# Altium schematic sheet Badschematic.SchDoc
size A4; SheetNumber: 1; SheetTotal: 2
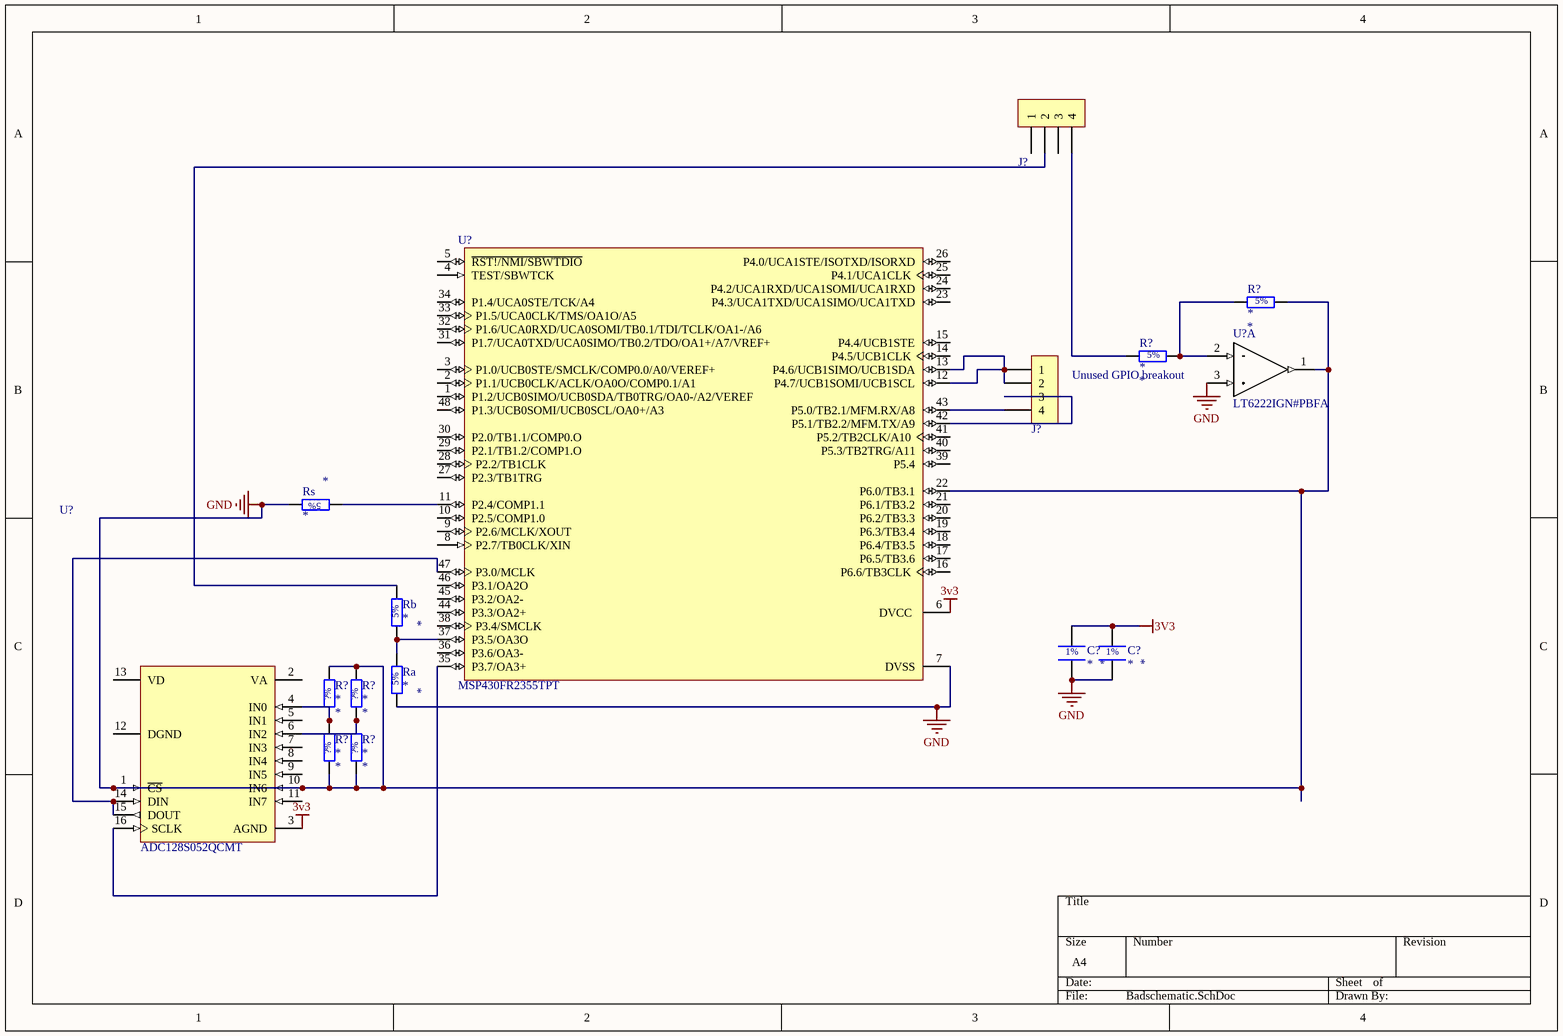
[diagram p0: Badschematic.SchDoc]

## Parts
(Parts that share a designator on the sheet are numbered #1, #2 ... from top to bottom, then left to right.)
C?#1  *  [CAPACITOR_0402_1005M_55N]
C?#2  *  [CAPACITOR_0402_1005M_55N]
J?#1  0530470410  [MOLEX_0530470410]  (value not drawn)
J?#2  0530470410  [MOLEX_0530470410]  (value not drawn)
R?#1  *  [Resistor_0805_2012M-50N]
R?#2  *  [Resistor_0805_2012M-50N]
R?#3  *  [RESISTOR_0805_2012M-50N]
R?#4  *  [RESISTOR_0805_2012M-50N]
R?#5  *  [CAPACITOR_0402_1005M_55N]
R?#6  *  [RESISTOR_0805_2012M-50N]
Ra  *  [Resistor_0805_2012M-50N]
Rb  *  [Resistor_0805_2012M-50N]
Rs  *  [Resistor_0805_2012M-50N]
U?#1  LT6222IGN#PBFA  [SSOP-16N-3.9mmBody-1.75mm]  (part A of 5)
U?#2  MSP430FR2355TPT  [LQFP_PT_48_N]
U?#3  ADC128S052QCMT  [TSSOP-16N_4.4mmBody-1.2mm]

## Nets
3V3: C?#1.2 C?#2.2 U?#2.6(DVCC) U?#3.3(AGND)
GND: C?#1.1 C?#2.1 R?#1.2 R?#3.2 R?#4.2 R?#5.1 R?#6.1 Ra.1 Rs.2 U?#1.1(OUT1) U?#1.3(IN1+) U?#2.7(DVSS) U?#2.22(P6.0/TB3.1) U?#3.1(~{CS}) U?#3.10(IN6)
NetJ?#1_2: J?#1.2 Rb.2
NetJ?#1_4: J?#1.4 R?#2.1
NetJ?#2_1: J?#2.1 J?#2.2 U?#2.12(P4.7/UCB1SOMI/UCB1SCL) U?#2.13(P4.6/UCB1SIMO/UCB1SDA)
NetJ?#2_3: J?#2.3 U?#2.42(P5.1/TB2.2/MFM.TX/A9)
NetJ?#2_4: J?#2.4 U?#2.43(P5.0/TB2.1/MFM.RX/A8)
NetR?#1_1: R?#1.1 R?#2.2 U?#1.2(IN1-)
NetR?#3_1: R?#3.1 R?#5.2 U?#3.4(IN0)
NetR?#4_1: R?#4.1 R?#6.2 U?#3.6(IN2)
NetRa_2: Ra.2 Rb.1 U?#2.37(P3.5/OA3O)
NetRs_1: Rs.1 U?#2.11(P2.4/COMP1.1)
NetU?#2_35: U?#2.35(P3.7/OA3+) U?#3.16(SCLK)
NetU?#2_47: U?#2.47(P3.0/MCLK) U?#3.14(DIN) U?#3.15(DOUT)

Not connected (* = marked no-connect by the designer): J?#1 1 3; U?#2 1(P1.2/UCB0SIMO/UCB0SDA/TB0TRG/OA0-/A2/VEREF) 2(P1.1/UCB0CLK/ACLK/OA0O/COMP0.1/A1) 3(P1.0/UCB0STE/SMCLK/COMP0.0/A0/VEREF+) 4(TEST/SBWTCK) 5(~{RST!/NMI/SBWTDIO}) 8(P2.7/TB0CLK/XIN) 9(P2.6/MCLK/XOUT) 10(P2.5/COMP1.0) 14(P4.5/UCB1CLK) 15(P4.4/UCB1STE) 16(P6.6/TB3CLK) 17(P6.5/TB3.6) 18(P6.4/TB3.5) 19(P6.3/TB3.4) 20(P6.2/TB3.3) 21(P6.1/TB3.2) 23(P4.3/UCA1TXD/UCA1SIMO/UCA1TXD) 24(P4.2/UCA1RXD/UCA1SOMI/UCA1RXD) 25(P4.1/UCA1CLK) 26(P4.0/UCA1STE/ISOTXD/ISORXD) 27(P2.3/TB1TRG) 28(P2.2/TB1CLK) 29(P2.1/TB1.2/COMP1.O) 30(P2.0/TB1.1/COMP0.O) 31(P1.7/UCA0TXD/UCA0SIMO/TB0.2/TDO/OA1+/A7/VREF+) 32(P1.6/UCA0RXD/UCA0SOMI/TB0.1/TDI/TCLK/OA1-/A6) 33(P1.5/UCA0CLK/TMS/OA1O/A5) 34(P1.4/UCA0STE/TCK/A4) 36(P3.6/OA3-) 38(P3.4/SMCLK) 39(P5.4) 40(P5.3/TB2TRG/A11) 41(P5.2/TB2CLK/A10) 44(P3.3/OA2+) 45(P3.2/OA2-) 46(P3.1/OA2O) 48(P1.3/UCB0SOMI/UCB0SCL/OA0+/A3); U?#3 2(VA) 5(IN1) 7(IN3) 8(IN4) 9(IN5) 11(IN7) 12(DGND) 13(VD)

## Notes on the sheet
- (near R?#2) Unused GPIO breakout
- (in symbol GCM1555CxxxxxF Series) 1%

## Library data of the parts
C?#1 C?#2 = GCM1555CxxxxxF Series: Passive - Capacitor Series, 0402, C0G, 50V, ±1%, -55°C ~ 125°C, 0402 (1005 Metric); Capacitance at Rated Voltage: 100%; Value Range: 5pF ~ 1nF; E Series: E24; Tolerance: ±1%; Temperature Coefficient: C0G; Rated Voltage: 50V; Temp Range: -55°C ~ 125°C; Supplier 1: Digikey; Package: 0402; MF Part No.: *; Value: *
J?#1 J?#2 = 0530470410: Header - Picoblade 04-pin, TH, STR; Pitch: 1.25mm; Mounting Type: Through-hole; Orientation: Straight; MF Part No.: 0530470410; Pins: 4; Supplier 1: Digikey; Supplier 1 Part No.: 530470410
R?#1 R?#2 Ra Rb Rs = RMCF0805JT Series: Passive - Resistor Series, 0805, 5%, 100m - 22M, E24, 0.063W, 1/16W, ±200ppm/°C, -55°C ~ 155°C, 0805 (2012 Metric); Power: 1/8W; Value Range: 100m ~ 22M; Rated Voltage: 150V; Tolerance: 5%; E Series: E24; Temp Range: -55°C ~ 155°C; Supplier 1: Digikey; Package: 0805; Temperature Coefficient: ±200ppm/°C; MF Part No.: *; Value: *
R?#3-R?#6 = Generic Resistor: Passive - Resistor, Generic; Tolerance: ?%; MF Part No.: *; Value: *
U?#1 = LT6222IGN#PBF: IC - Opamp, High Speed, 4-Channel, 60MHz GBWP, RRIO, 2.2V to 12.6V, -40 to 85, SSOP-16; Temp Range: -40°C ~ 85°C; Package: TSSOP-16; MF Part No.: LT6222IGN#PBF; Rated Voltage: 12.6V; Supplier 1: Digikey; Supplier 1 Part No.: LT6222IGN#PBF-ND
U?#2 = MSP430FR2355TPT: IC - Microcontroller, 24MHz, 32KB FRAM, Op-Amps/PGAs, 12-bit DACs, 12-bit ADC, 48-LQFP, -40 to 105C; Temp Range: -40°C ~ 105°C; Rated Voltage: 3.6V; MF Part No.: MSP430FR2355TPT; Package: LQFP-48; Supplier 1: Digikey; Supplier 1 Part No.: 296-50260-ND
U?#3 = ADC128S052QCMT: IC - ADC, 8-Channel, 12-bit, SPI, Split digital/analog Vcc; MF Part No.: ADC128S052QCMT/NOPB-ND; Temp Range: -40°C ~ 105°C; Rated Voltage: 5.25V; Footprint: TSSOP-16; Package: TSSOP-16; Supplier 1: Digikey; Supplier 1 Part No.: ADC128S052CIMT/NOPB-ND